# Altium schematic sheet DC-DC Converter.SchDoc
size Legal
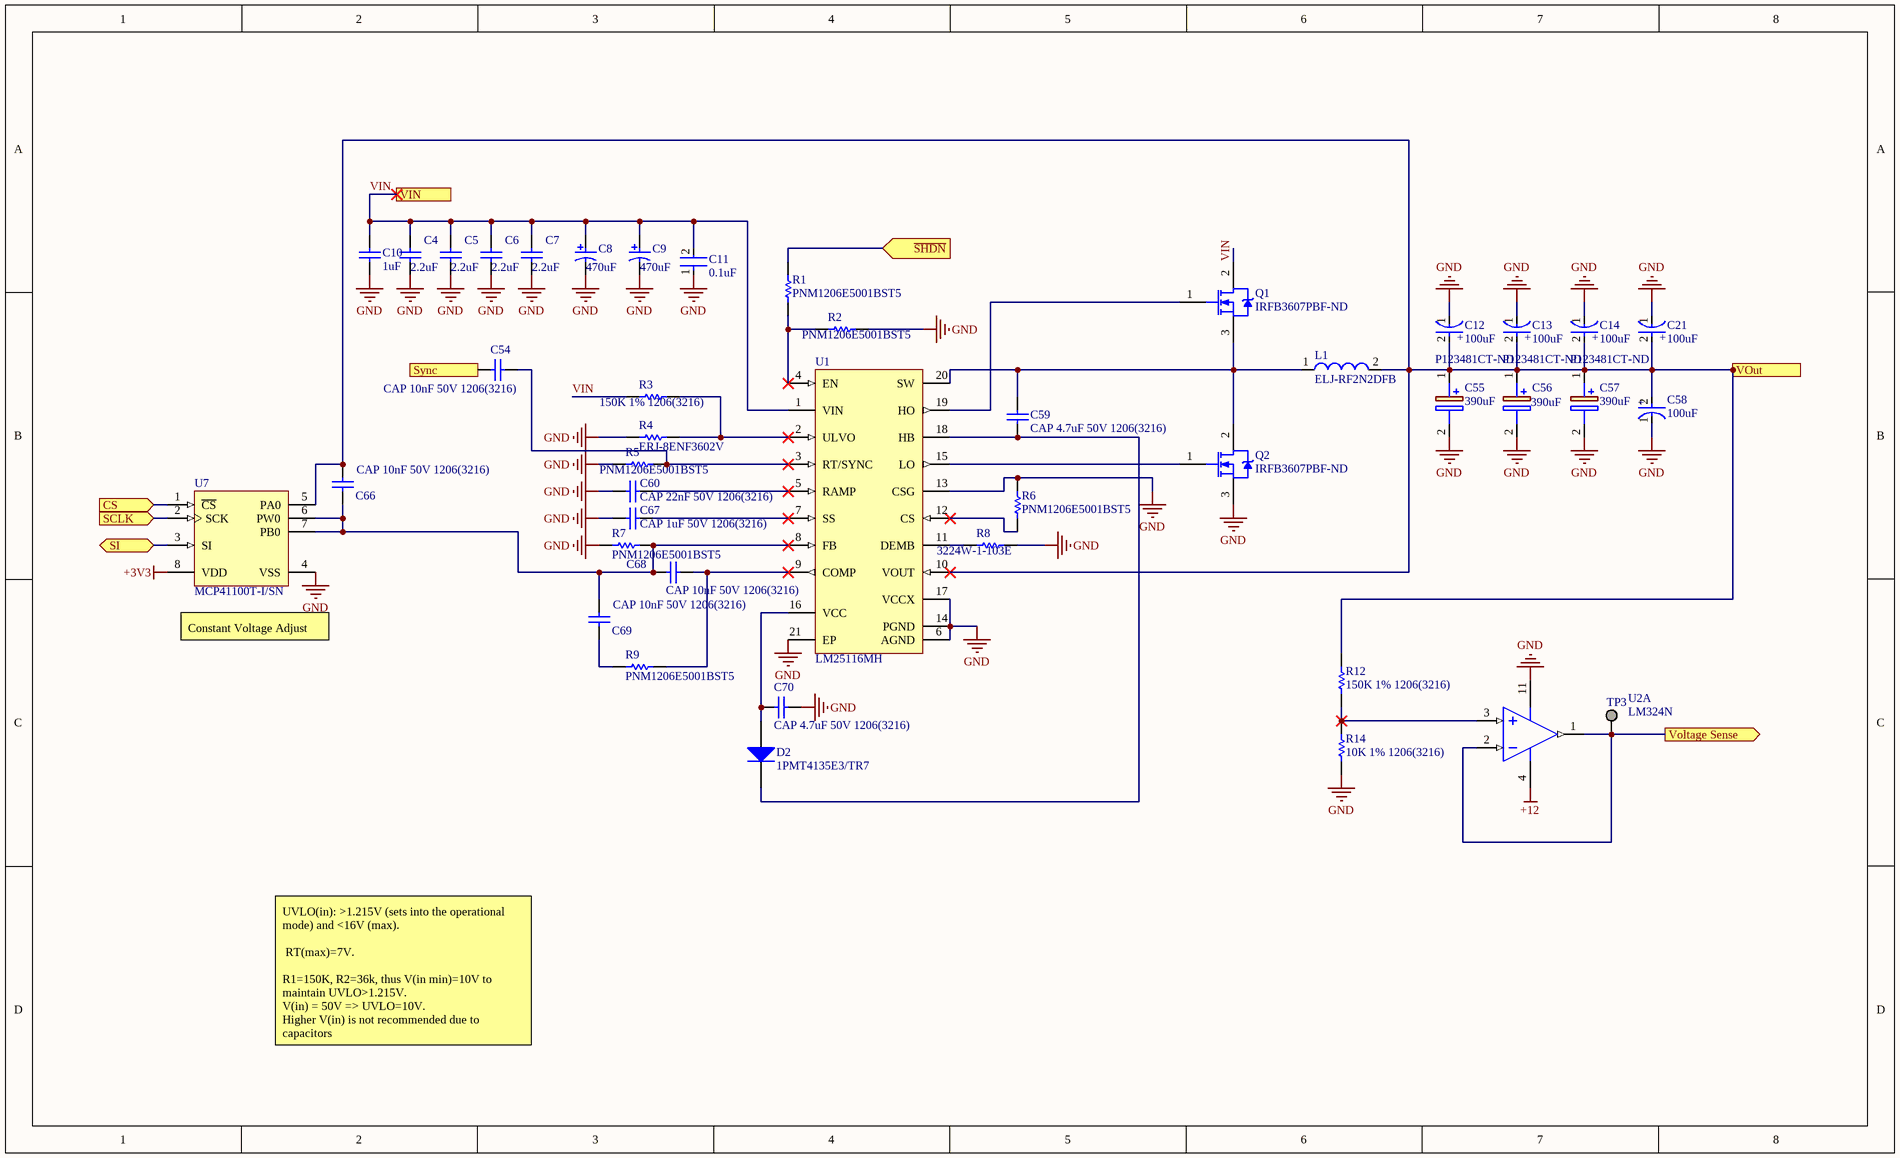
[diagram p0: DC-DC Converter.SchDoc]

## Parts
C4  value 2.2uF  [CAPC1812(4532)280_L]  (hidden comment: CAP 2.2uF 100V 1812(4532))
C5  value 2.2uF  [CAPC1812(4532)280_L]  (hidden comment: CAP 2.2uF 100V 1812(4532))
C6  value 2.2uF  [CAPC1812(4532)280_L]  (hidden comment: CAP 2.2uF 100V 1812(4532))
C7  value 2.2uF  [CAPC1812(4532)280_L]  (hidden comment: CAP 2.2uF 100V 1812(4532))
C8  470uF  [PNSC-EEV-FK1J471M_L]
C9  470uF  [PNSC-EEV-FK1J471M_L]
C10  1uF  [CAPC3216X180X55LL15T30]
C11  0.1uF  [FP-C1206C-EB-IPC_B]
C12  100uF  [FP-EEE-FK1H101P-MFG]
C13  100uF  [FP-EEE-FK1H101P-MFG]
C14  100uF  [FP-EEE-FK1H101P-MFG]
C21  100uF  [FP-EEE-FK1H101P-MFG]
C54  CAP 10nF 50V 1206(3216)  [CAPC1206(3216)150_L]
C55  390uF  Supplier Part Number 1: P123481CT-ND  [CAPAE1700X1700N]
C56  390uF  Supplier Part Number 1: P123481CT-ND  [CAPAE1700X1700N]
C57  390uF  Supplier Part Number 1: P123481CT-ND  [CAPAE1700X1700N]
C58  100uF  [FP-EEE-FK1H101P-MFG]
C59  CAP 4.7uF 50V 1206(3216)  [MURA-1206_H_1.8_L]
C60  CAP 22nF 50V 1206(3216)  [CAPC1206(3216)170_L]
C66  CAP 10nF 50V 1206(3216)  [CAPC1206(3216)150_L]
C67  CAP 1uF 50V 1206(3216)  [CAPC3216X180X20LL20]
C68  CAP 10nF 50V 1206(3216)  [CAPC1206(3216)150_L]
C69  CAP 10nF 50V 1206(3216)  [CAPC1206(3216)150_L]
C70  CAP 4.7uF 50V 1206(3216)  [MURA-1206_H_1.8_M]
D2  1PMT4135E3/TR7  [1PMT4135E]
L1  ELJ-RF2N2DFB  [WE-HCI-1890]
Q1  Supplier Part Number 1: IRFB3607PBF-ND  [INTR-TO-220AB-3_A]  (hidden comment: MOSFET for DCDC)
Q2  Supplier Part Number 1: IRFB3607PBF-ND  [INTR-TO-220AB-3_A]  (hidden comment: MOSFET for DCDC)
R1  PNM1206E5001BST5  [RESC1206(3216)_L]
R2  PNM1206E5001BST5  [RESC3216X60X45LL10T20]
R3  150K 1% 1206(3216)  [RESC1206(3216)_L]
R4  ERJ-8ENF3602V  [RESC3216X70X50NL05T20]
R5  PNM1206E5001BST5  [RESC3216X60X45LL10T20]
R6  PNM1206E5001BST5  [RESC3216X89X51LL25T25]
R7  PNM1206E5001BST5  [RESC3216X60X45LL10T20]
R8  3224W-1-103E  [RESC3216X60X45LL10T20]
R9  PNM1206E5001BST5  [RESC3216X60X45LL10T20]
R12  150K 1% 1206(3216)  [RESC1206(3216)_L]
R14  10K 1% 1206(3216)  [RESC1206(3216)_L]
TP3  VS  [KSTN-1502-2]  (value not drawn)
U1  LM25116MH  [PWP0020A_L]
U2  LM324N  [N14A]  (part A of 4)
U7  MCP41100T-I/SN  [SOIC-SN8_L]

## Ports
CS (in), SCLK (in), SI (bidir), Sync (in), VIN, Voltage Sense (out), VOut (out), ~{SHDN} (in)

## Nets
+3V3: U7.8(VDD)
+12: U2.4(V+)
GND: C4.1 C5.1 C6.1 C7.1 C8.2 C9.2 C10.1 C11.1 C12.1(C) C13.1(C) C14.1(C) C21.1(C) C55.2(-) C56.2(-) C57.2(-) C58.1(C) C60.1 C67.1 C70.2 Q2.3(S) R2.1 R4.1 R5.1 R6.2 R7.1 R8.2 R14.2 U1.6(AGND) U1.13(CSG) U1.14(PGND) U1.17(VCCX) U1.21(EP) U2.11(GND) U7.4(VSS)
CS: U7.1(~{CS}) ; port CS
~{SHDN}: R1.2 ; port ~{SHDN}
SCLK: U7.2(SCK) ; port SCLK
SI: U7.3(SI) ; port SI
Sync: C54.2 ; port Sync
VIN: C4.2 C5.2 C6.2 C7.2 C8.1 C9.1 C10.2 C11.2 Q1.2(D) R3.2 U1.1(VIN) ; port VIN
Voltage Sense: TP3.1 U2.1(OUT1) U2.2(IN1-) ; port Voltage Sense
VOut: C12.2(A) C13.2(A) C14.2(A) C21.2(A) C55.1(+) C56.1(+) C57.1(+) C58.2(A) C66.1 L1.2 R12.2 U1.10(VOUT) U7.5(PA0) ; port VOut
NetC54_1: C54.1 R5.2 U1.3(RT/SYNC)
NetC59_1: C59.1 L1.1 Q1.3(S) Q2.2(D) U1.20(SW)
NetC59_2: C59.2 D2.2(K) U1.18(HB)
NetC60_2: C60.2 U1.5(RAMP)
NetC66_2: C66.2 C68.1 C69.1 R7.2 U1.8(FB) U7.6(PW0) U7.7(PB0)
NetC67_2: C67.2 U1.7(SS)
NetC68_2: C68.2 R9.2 U1.9(COMP)
NetC69_2: C69.2 R9.1
NetC70_1: C70.1 D2.1(A) U1.16(VCC)
NetQ1_1: Q1.1(G) U1.19(HO)
NetQ2_1: Q2.1(G) U1.15(LO)
NetR1_1: R1.1 R2.2 U1.4(EN)
NetR3_1: R3.1 R4.2 U1.2(ULVO)
NetR6_1: R6.1 U1.12(CS)
NetR8_1: R8.1 U1.11(DEMB)
NetR12_1: R12.1 R14.1 U2.3(IN1+)

## Notes on the sheet
- Text
- (near U7) Constant Voltage Adjust
- UVLO(in): >1.215V (sets into the operational mode) and <16V (max).
  RT(max)=7V.
  R1=150K, R2=36k, thus V(in min)=10V to maintain UVLO>1.215V.
  V(in) = 50V => UVLO=10V.
  Higher V(in) is not recommended due to capacitors
- (in symbol CMP-05427-000005-1) +

## Library data of the parts
C4-C7 = CMP-1040-01635-1: CAP 2.2uF 100V ±10% 1812 (4532 Metric) Thickness 2.8mm SMD; Case-Metric: 4532; Case-EIA: 1812; Tolerance: Â±10%; Rated Voltage: 100 V; Max Thickness: 2.8 mm; Technology: SMT; Supplier 1: Digi-Key; Supplier Part Number 1: 445-4510-2-ND
C8 C9 = CMP-1665-00018-3: Aluminum Electrolytic Capacitor (SMD Type), 470 uF, 63 V, -55 to 105 degC, 2-Pin CAPAE, RoHS, Tape and Reel; Manufacturer: Panasonic; Voltage Rating: 63 V; Mounting Technology: Surface Mount; Length: 17 mm; PackageDescription: 2-Pin Electrolytic Aluminum Capacitor, Body 17 x 17 mm; Package Quantity: 125; ComponentLink1URL: http://www.panasonic.com/; RoHSCompliant: true; REACH SVHC: Unknown; Pins: 2; DatasheetVersion: 03/2016; PackageReference: EEV-FK1J471M; Min Operating Temperature: -55 degC; ComponentLink2URL: https://industrial.panasonic.com/cdbs/www-data/pdf/RDE0000/ABA0000C1181.pdf; Height: 16.5 mm; ComponentLink2Description: Datasheet; ComponentLink1Description: Manufacturer URL; Mount: Surface Mount; Packaging: Tape and Reel; Max Operating Temperature: 105 degC
C10 = CMP-2000-06418-1: Chip Capacitor, 1 uF, +/- 10%, 100 V, -55 to 125 degC, 1206 (3216 Metric), RoHS, Tape and Reel / HMK316B7105KL-T; PCN Part Number: X5R,X7RDielectrics23/Jan/2008; Manufacturer: Taiyo Yuden; Other Names: 587-1777-1; Online Catalog: MSeries; Kits: 587-1794-KIT-ND-KITCAPCERAMICHICAPMLCCSMD; Temperature Coefficient: X7R; Voltage - Rated: 100V; Catalog Drawings: xMKSeries_1206_1.6; Capacitance: 1µF; Standard Package: 1; Manufacturer URL: http://www.t-yuden.com/; Mounting Technology: SurfaceMount; Height - Seated (Max): -; Lead Style: -; Mounting Type: SurfaceMount,MLCC; Thickness (Max): 0.071"(1.80mm); Applications: GeneralPurpose; Lead Spacing: -; Operating Temperature: -55°C~125°C; Size / Dimension: 0.126"Lx0.063"W(3.20mmx1.60mm); Features: HighVoltage; Ratings: -; Category: Capacitors; Datasheet Version: 09/2015; Package Description: 2-Pin Surface Mount Device, Body 3.2 x1.6 mm; Tolerance: ±10%; Family: CeramicCapacitors; Package Reference: 1206; Packaging: CutTape(CT); Datasheet URL: http://www.yuden.co.jp/productdata/catalog/en/mlcc_all_e.pdf; Package / Case: 1206(3216Metric); Series: M
C11 = CMP-03020-006091-1: CAP CER 0.1UF 50V U2J 1206; Manufacturer: KEMET; Manufacturer Part Number: C1206C104J5JACTU; Temperature Coefficient: 15%; Tolerance: 0.05; Value: 0.10 μF; Material: Ceramic; Automotive Grade: Grade 0; Height: 0.88mm; Category: Cap; Temperature Range Low: -55°C; ComponentLink2Description: Datasheet; Ipc Land Pattern Name: CAPC320160X78; Device Class L1: Passive Components; Lead Free: Yes; Package: C1206C-EB; Device Class L3: Ceramic Capacitors; Temperature Characteristic: U2J; Automotive: Yes; Temperature Range High: +150°C; ComponentLink2URL: https://content.kemet.com/datasheets/KEM_C1007_X8R_ULTRA_150C_SMD.pdf; Digikey Description: CAP CER 0.1UF 50V U2J 1206; RoHS: TRUE; Capacitance: 0.10 μF; Device Class L2: Capacitors; Octopart: https://octopart.com/c1206c104j5jactu-kemet-74675307; Voltage Rating: 50 V; Temperature: -55°C to +150°C
C12-C14 C21 C58 = CMP-05427-000005-1: CAP ALUM 100UF 20% 50V SMD / EEE-FK1H101P; Manufacturer: Panasonic Electronic Components; Automotive Grade: Grade 2; Dissipation Factor: 10%; Life: 2000Hours; Ripple Current: 350mA; Material: Aluminum; Esr: 0.34Ω; Leakage Current: 50uA; Tolerance: 20%; Package: 0; ComponentLink2URL: https://industrial.panasonic.com/cdbs/www-data/pdf/RDE0000/ABA0000C1181.pdf; Manufacturer Part Number: EEE-FK1H101P; Temperature Range Low: -55°C; Voltage Rating: 50V; ComponentLink2Description: Datasheet; Category: Cap; Digikey Description: CAP ALUM 100UF 20% 50V SMD; Octopart: https://octopart.com/eeefk1h101p-panasonic-4642841; Automotive: Yes; Temperature: -55°C to +105°C; Capacitance: 100uF; Lead Free: Yes; Mouser Description: Cap Aluminum Lytic 100uF 50V 20% (8 X 10.2mm) SMD 350mA 2000h 105C Automotive T/R; Height: 10.5mm; Device Class L3: Aluminum Electrolytic Capacitors; Value: 100uF; Device Class L1: Passive Components; RoHS: TRUE; Device Class L2: Capacitors; Temperature Range High: +105°C
C54 C66 C68 C69 = CMP-1037-03511-1: CAP 10nF 50V ±10% 1206 (3216 Metric) Thickness 1.45mm SMD; Case-Metric: 3216; Tolerance: Â±10%; Case-EIA: 1206; Value: 10nF; Rated Voltage: 50 V; Max Thickness: 1.45 mm; Technology: SMT
C55-C57 = EEE-TP1K391V: 390uF +-20% 80V / Capacitor Polarised / EEE-TP1K391V; Manufacturer_Name: Panasonic; Datasheet Link: https://industrial.panasonic.com/cdbs/www-data/pdf/RDE0000/RDE0000C1255.pdf; Height: 17mm; Manufacturer_Part_Number: EEE-TP1K391V; Mouser Part Number: 667-EEE-TP1K391V; Mouser Price/Stock: https://www.mouser.co.uk/ProductDetail/Panasonic/EEE-TP1K391V?qs=XFmntM7Yc9dUeO1BN5vyvw%3D%3D; Supplier 1: Digi-Key
C59 = CMP-2000-05258-1: CAP, Ceramic, 4.7 uF, 10%, 50 V, 1206, RoHS, Tape and ReelReelGRM31CR71H475KA12L; Manufacturer: Murata; Capacitance: 4700000pF; Dielectric: X7R; Manufacturer URL: http://www.murata.com/; Datasheet URL: https://datasheet.ciiva.com/29201/451984-da-01-en-vs-kondensator-0603-29201725.pdf; Datasheet Version: Dec-10; Case Size/Dimension: 1206; Tolerance (%): ±10%; Rated Voltage: 50V
C60 = CMP-1037-03785-1: CAP 22nF 200V ±10% 1206 (3216 Metric) Thickness 1.7mm SMD; Case-Metric: 3216; Tolerance: Â±10%; Case-EIA: 1206; Value: 22nF; Max Thickness: 1.7 mm; Rated Voltage: 200 V; Technology: SMT
C67 = CMP-2000-06049-1: Chip Capacitor, 1 uF, +/- 10%, 100 V, -55 to 125 degC, 1206 (3216 Metric), RoHS, Tape and Reel; Manufacturer: TDK; PCN Part Number: MLCCPartNumberChange30/Nov/2012; Kits: SAMPLEKIT1008-ND-KITCAPCERMLCC100V-630V; Product Training Modules: SEAT,CCV,andTVCLDesignToolsGuidetoReplacinganElectrolyticCapacitorwithanMLCC; Capacitance: 1µF; Featured Product: C-SeriesMidVoltageMLCCs; Voltage - Rated: 100V; Other Names: 445-4467-1; Catalog Drawings: CSERIES_1206_1.8; Online Catalog: CSeries,MidVoltage; Temperature Coefficient: X7R; Features: -; Family: CeramicCapacitors; Datasheet URL: http://www.farnell.com/datasheets/1484596.pdf; Mounting Technology: SurfaceMount; Mounting Type: SurfaceMount,MLCC; Datasheet Version: 08/2011; Standard Package: 1; Package / Case: 1206(3216Metric); Thickness (Max): 0.051"(1.30mm); Size / Dimension: 0.126"Lx0.063"W(3.20mmx1.60mm); Applications: GeneralPurpose; Package Reference: 1206; Operating Temperature: -55°C~125°C; Packaging: CutTape(CT); Package Description: 2-Pin Surface Mount Device, Body 3.2 x 1.6 mm; Ratings: -; Series: C; Tolerance: ±10%; Manufacturer URL: http://www.tdk.com/; Lead Spacing: -; Height - Seated (Max): -; Package URL: https://product.tdk.com/info/en/documents/chara_sheet/C3216X7R1V106K160AC.pdf; Lead Style: -; Category: Capacitors; RoHS Information: RoHSCertificate-MLCC
C70 = CMP-2000-05258-1: CAP, Ceramic, 4.7 uF, 10%, 50 V, 1206, RoHS, Tape and ReelGRM31CR71H475KA12L; Manufacturer: Murata; Capacitance: 4700000pF; Dielectric: X7R; Manufacturer URL: http://www.murata.com/; Datasheet URL: https://datasheet.ciiva.com/29201/451984-da-01-en-vs-kondensator-0603-29201725.pdf; Datasheet Version: Dec-10; Case Size/Dimension: 1206; Tolerance (%): ±10%; Rated Voltage: 50V
D2 = CMP-2000-05518-2: Surface Mount Fast Switching Diode, -65 to 150 degC, 2-Pin SOD523, RoHS, Tape and Reel; PartNumber: 1N4148WT; Manufacturer: Diodes Inc; Diode Configuration: Single; Number of Elements per Chip: 1; Forward Current: 250mA; Datasheet URL: http://www.diodes.com/_files/datasheets/ds30396.pdf; Mounting Technology: SurfaceMount; Manufacturer URL: http://www.diodes.com/; Package URL: http://www.diodes.com/_files/packages/SOD523.pdf; Pin Count: 2; Package Description: 2-Pin Small Outline Diode, Body 1.2 x 0.8 mm; Package Reference: SOD523-2; Mounting Type: SurfaceMount; Package Type: SOD-523; Datasheet Version: Rev. 16-2, 11/2015
L1 = CMP-0226-00001-1: SMD Flat Wire High Current Inductor WE-HCI, L=10.0 µH; Inductance: 10.0 ÂµH; PackageReference: WE-HCI-1890; ComponentLink1Description: Manufacturer Link; DatasheetVersion: ver 2, Nov-2009; PackageDescription: Inductor, 2-Leads, Body 18.3 x 18.2 mm; ComponentLink2URL: http://www.we-online.de/katalog/media/pdf/74435561100.pdf; PackageVersion: 2009; ComponentLink1URL: http://www.we-online.com; ComponentLink2Description: Datasheet
Q1 Q2 = IRFB3607PBF: INTERNATIONAL RECTIFIER   IRFB3607PBF   MOSFET Transistor, N Channel, 80 A, 75 V, 0.00734 ohm, 10 V, 4 V; Continuous Drain Current (ID): 80A; Gate to Source Voltage (Vgs): 20V; Turn-Off Delay Time: 43ns; Turn-On Delay Time: 16ns; Rise Time: 110ns; Fall Time: 96ns; Drain to Source Voltage (Vdss): 75V; Power Dissipation: 140W; Drain to Source Resistance: 9mR; Input Capacitance: 3.07nF; Threshold Voltage: 4V; Element Configuration: Single; Number of Elements: 1; Recovery Time: 50ns; Supplier 1: Digi-Key; Manufacturer: International Rectifier; Manufacturer Part Number: IRFB3607PBF; Stock 1: 2332; Pricing 1: 1 = 0.85000, 10 = 0.75100, 25 = 0.70520, 100 = 0.51190, 250 = 0.49368, 500 = 0.42770, 1000 = 0.36400, 2500 = 0.34125, 5000 = 0.30713 (USD); RoHS: Yes; Mount: Through Hole; Case/Package: TO-220AB; Number of Pins: 3; Min Operating Temperature: -55°C; Max Operating Temperature: 175°C; Drain to Source Breakdown Voltage: 75V; Max Power Dissipation: 140W; Rds On Max: 9mR; Packaging: Rail/Tube; Package Quantity: 50; Termination: Through Hole; Dual Supply Voltage: 75V; On-State Resistance: 9MR; Nominal Vgs: 4V; Length: 10.66mm; Height: 9.02mm; Width: 4.82mm; Radiation Hardening: No; Lead Free: Lead Free; REACH SVHC: No SVHC; ComponentLink1URL: https://datasheet.ciiva.com/14170/irfs3607pbf-eng-tds-14170693.pdf?src-supplier=Distrelec; ComponentLink1Description: https://datasheet.ciiva.com/14170/irfs3607pbf-eng-tds-14170693.pdf?src-supplier=Distrelec; ComponentLink2URL: https://datasheet.ciiva.com/17315/irfs3607pbf-17315511.pdf?src-supplier=Avnet+Europe; ComponentLink2Description: https://datasheet.ciiva.com/17315/irfs3607pbf-17315511.pdf?src-supplier=Avnet+Europe; ComponentLink3URL: https://datasheet.ciiva.com/6368/irfs3607pbf-6368216.pdf?src-supplier=Digi-Key; ComponentLink3Description: https://datasheet.ciiva.com/6368/irfs3607pbf-6368216.pdf?src-supplier=Digi-Key; ComponentLink4URL: https://datasheet.ciiva.com/7798/irfs3607pbf-7798745.pdf?src-supplier=Element14; ComponentLink4Description: https://datasheet.ciiva.com/7798/irfs3607pbf-7798745.pdf?src-supplier=Element14; ComponentLink5URL: https://datasheet.ciiva.com/16355/irfs3607pbf-16355482.pdf?src-supplier=Future+Electronics; ComponentLink5Description: https://datasheet.ciiva.com/16355/irfs3607pbf-16355482.pdf?src-supplier=Future+Electronics
R1 = CMP-1014-00736-1: 100K 0.25W 1% 1206 (3216 Metric)  SMD; Case-EIA: 1206; Value: 100000.00 Ohm; Case-Metric: 3216; Tolerance: 1 %; Power: 0.25 W; Technology: SMT
R2 = CMP-2003-01906-1: Manufacturer: Vishay Dale; Part Number: CRCW12061M00FKEA
R3 R12 = CMP-1014-00754-1: 150K 0.25W 1% 1206 (3216 Metric)  SMD; Case-EIA: 1206; Value: 150000.00 Ohm; Case-Metric: 3216; Technology: SMT; Power: 0.25 W; Tolerance: 1 %
R4 = CMP-2003-00329-1: Manufacturer: Panasonic; Part Number: ERJ-8ENF3602V
R5 = CMP-2003-01940-1: Manufacturer: Vishay Dale; Part Number: CRCW120620K0FKEA
R6 = CMP-2003-04339-1: Manufacturer: Vishay Dale; Part Number: WSL12064L000FEA
R7 = CMP-2003-02155-1: Part Number: CRCW12063K60FKEA; Manufacturer: Vishay Dale
R8 = CMP-2003-04820-1: Part Number: CRCW1206110KFKEA; Manufacturer: Vishay Dale
R9 = CMP-2003-02122-1: Part Number: CRCW120636K0JNEA; Manufacturer: Vishay Dale
R14 = CMP-1014-00623-1: 10K 0.25W 1% 1206 (3216 Metric)  SMD; Case-Metric: 3216; Value: 10000.00 Ohm; Case-EIA: 1206; Power: 0.25 W; Technology: SMT; Tolerance: 1 %
TP3 = CMP-1672-00001-4: Terminal DBL Turret, Through Hole, RoHS; Contact Finish: Tin; Lead Pitch: 0.218 inch; PackageReference: 1502-2; Mount: Through Hole; Pins: 50; DatasheetVersion: Rev. A, 02/2008; RoHSCompliant: true; REACH SVHC: No SVHC; Contact Material: Brass; Length: 2.77 mm; PackageDescription: 1-Pin Through Hole Device, Dia 3.18 mm; Package Quantity: 1; Mounting Technology: Through Hole; Supplier 1: Mouser; Supplier Part Number 1: 575-2501200800000
U1 = CMP-0069-01392-3: Wide Range Synchronous Buck Controller, 20-pin TSSOP-EP; Manufacturer: Texas Instruments; CompType: Switcher; PackageTopMarking: NSUZXYTT*LM25116*MH; PowerWise: Y; ComponentLink1Description: Datasheet URL; PackageDescription: Molded TSSOP, Jedec, 6.5 x 4.4 x 0.9mm Body, 20 Lead, 0.65mm Pitch, Exposed Pad; RoHS: N; ComponentLink1URL: http://www.ti.com/general/docs/lit/getliterature.tsp?genericPartNumber=LM25116&fileType=pdf; PackageReference: PWP0020A; Code_JEDEC: MO-153-ACT; PinCount: 20
U2 = CMP-0055-00082-1: Low Power Quad Operational Amplifier, 14-pin MDIP; Manufacturer: National Semiconductor; PackageTopMarking: NSUZXYYTTE#*LM324N; PowerWise: N; CompType: Amplifiers; PinCount: 14; PackageVersion: revG, May-2006; PackageReference: N14A; Code_JEDEC: MS-001-AA; PackageDescription: MDIP, .750 x .250 x.130in, 14 Lead, .100in Pitch; RoHS: N; DatasheetVersion: Aug-2000
U7 = CMP-0188-00044-2: Single/Dual Digital Potentiometer with SPI Interface, 8-Pin SOIC 150mil, Industrial Temperature, Tape and Reel; ComponentLink1URL: http://www.microchip.com/; PackageVersion: revBB, Aug-2009; ComponentLink2URL: http://ww1.microchip.com/downloads/en/DeviceDoc/11195c.pdf; Code_IPC: SOIC127P600-8; PackageReference: SOIC-SN8; RevisionNote: URLs added.; ComponentLink3Description: Package Specification; ComponentLink3URL: http://www.microchip.com/stellent/groups/techpub_sg/documents/packagingspec/en012702.pdf; ComponentLink2Description: Datasheet; DatasheetVersion: Jul-2003; PackageDescription: 8-Lead Plastic Small Outline (SN) - Narrow, 3.90mm Body [SOIC]; Code_JEDEC: MS-012; ComponentLink1Description: Manufacturer URL